# Altium project LS Light Board.PrjPCB
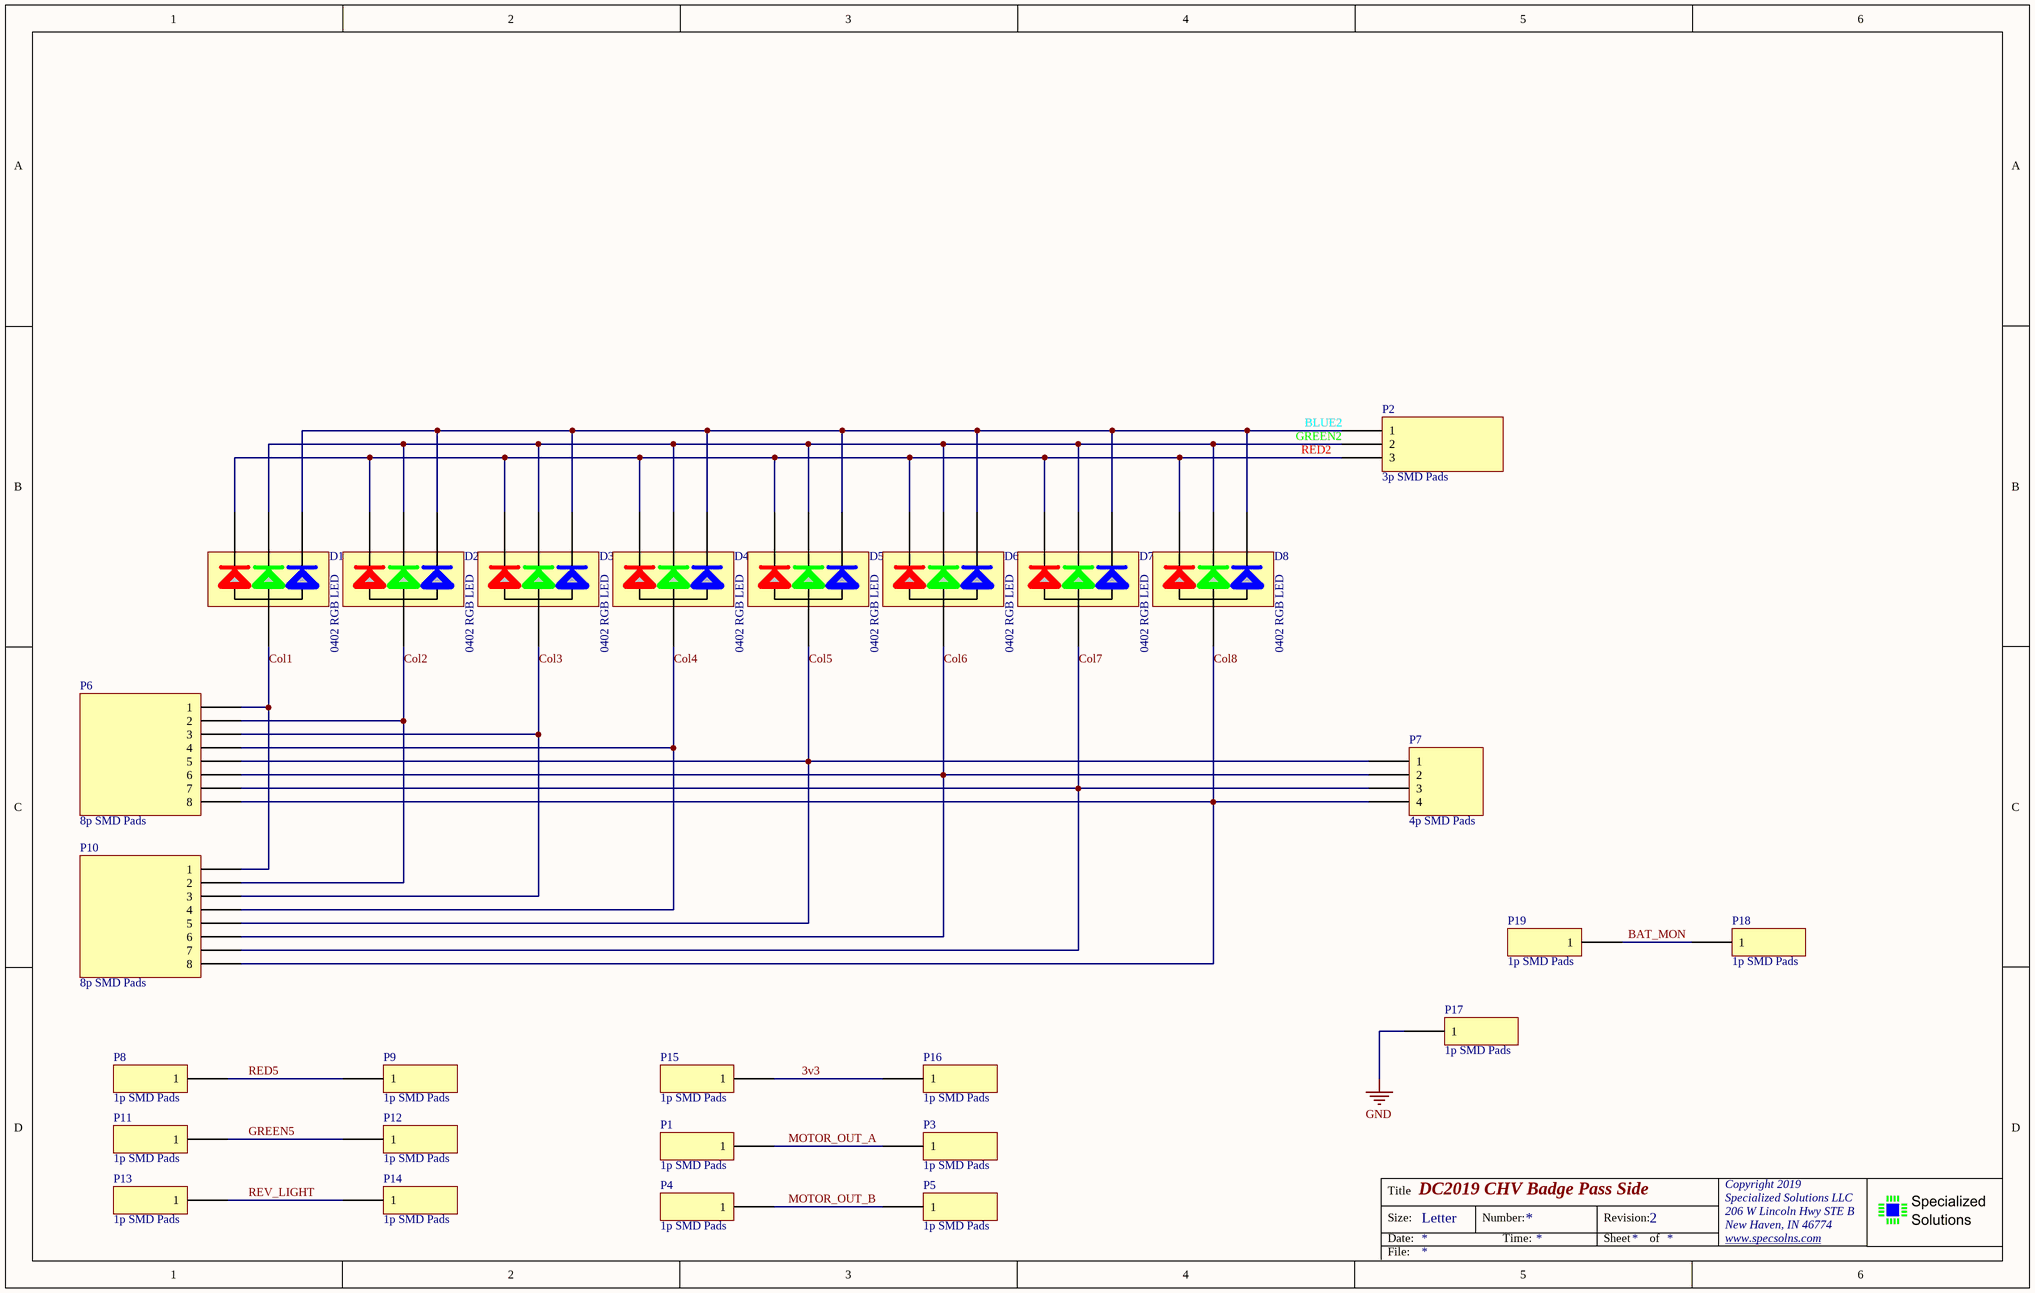
[diagram p0: RGB Matrix.SchDoc]
projecttitle: DC2019 CHV Badge Pass Side; projectrevision: 2
1 sheet, 27 parts. Net scope: global (net labels, ports and power ports of the same name join across sheets).
Board file: Passenger Side PCB.PcbDoc

## Sheet RGB Matrix.SchDoc
size B

### Parts
D1  0402 RGB LED  [0404 RGB LED]
D2  0402 RGB LED  [0404 RGB LED]
D3  0402 RGB LED  [0404 RGB LED]
D4  0402 RGB LED  [0404 RGB LED]
D5  0402 RGB LED  [0404 RGB LED]
D6  0402 RGB LED  [0404 RGB LED]
D7  0402 RGB LED  [0404 RGB LED]
D8  0402 RGB LED  [0404 RGB LED]
P1  1p SMD Pads  [1p SMD pad]
P2  3p SMD Pads  [3p SMD pad]
P3  1p SMD Pads  [1p SMD pad]
P4  1p SMD Pads  [1p SMD pad]
P5  1p SMD Pads  [1p SMD pad]
P6  8p SMD Pads  [8p SMD pad]
P7  4p SMD Pads  [4p SMD pad]
P8  1p SMD Pads  [1p SMD pad]
P9  1p SMD Pads  [1p SMD pad]
P10  8p SMD Pads  [8p SMD pad]
P11  1p SMD Pads  [1p SMD pad]
P12  1p SMD Pads  [1p SMD pad]
P13  1p SMD Pads  [1p SMD pad]
P14  1p SMD Pads  [1p SMD pad]
P15  1p SMD Pads  [1p SMD pad]
P16  1p SMD Pads  [1p SMD pad]
P17  1p SMD Pads  [1p SMD pad]
P18  1p SMD Pads  [1p SMD pad]
P19  1p SMD Pads  [1p SMD pad]

### Nets
GND: P17.1
3v3: P15.1 P16.1
BAT_MON: P18.1 P19.1
BLUE2: D1.4 D2.4 D3.4 D4.4 D5.4 D6.4 D7.4 D8.4 P2.1
Col1: D1.1 P6.1 P10.1
Col2: D2.1 P6.2 P10.2
Col3: D3.1 P6.3 P10.3
Col4: D4.1 P6.4 P10.4
Col5: D5.1 P6.5 P7.1 P10.5
Col6: D6.1 P6.6 P7.2 P10.6
Col7: D7.1 P6.7 P7.3 P10.7
Col8: D8.1 P6.8 P7.4 P10.8
GREEN2: D1.3 D2.3 D3.3 D4.3 D5.3 D6.3 D7.3 D8.3 P2.2
GREEN5: P11.1 P12.1
MOTOR_OUT_A: P1.1 P3.1
MOTOR_OUT_B: P4.1 P5.1
RED2: D1.2 D2.2 D3.2 D4.2 D5.2 D6.2 D7.2 D8.2 P2.3
RED5: P8.1 P9.1
REV_LIGHT: P13.1 P14.1

### Notes on the sheet
- Title
- Size:
- Date:
- Letter
- Number:
- Time:
- Revision:
- Sheet
- of
- Copyright 2019
- Specialized Solutions LLC
- 206 W Lincoln Hwy STE B
- New Haven, IN 46774
- www.specsolns.com <http://www.specsolns.com>
- File:

### Library data of the parts
P1 P3-P5 P8 P9 P11-P19 = 1p SMD
P2 = 3p SMD
P7 = 4p SMD